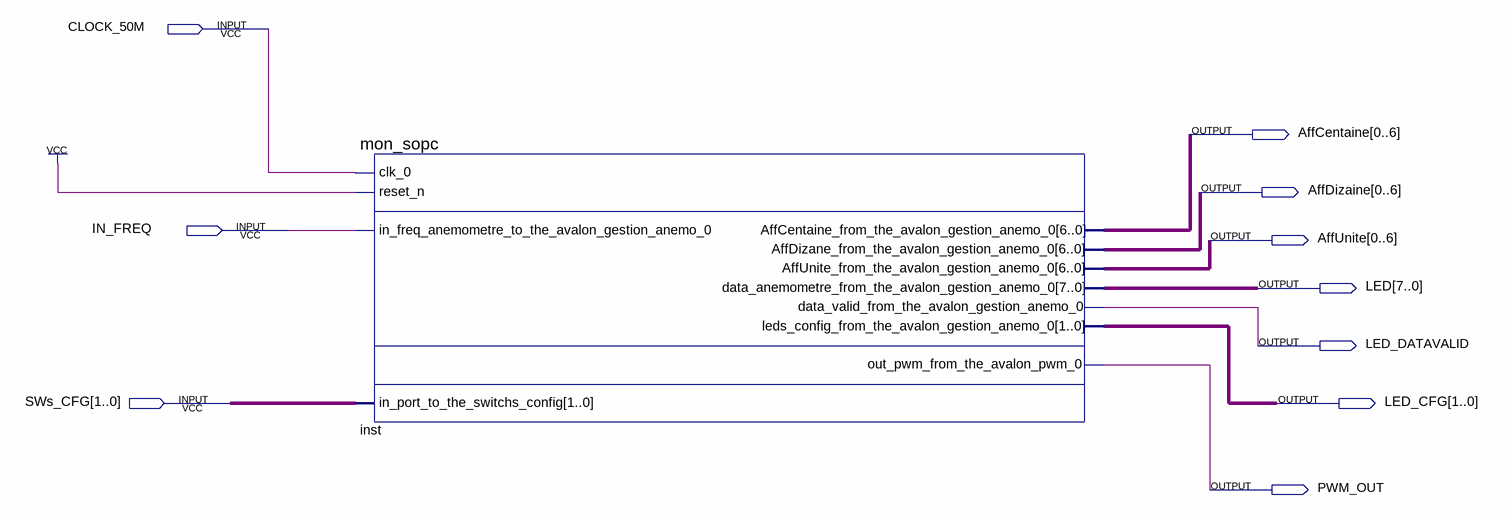
[diagram p0: schematic sheet]
// Quartus schematic sopc_be_Q11.bdf as structural Verilog: 1 symbols, 10 pins
module sopc_be_Q11 (
  input  CLOCK_50M,
  input  IN_FREQ,
  input  [1:0] SWs_CFG,
  output [0:6] AffCentaine,
  output [0:6] AffDizaine,
  output [0:6] AffUnite,
  output [7:0] LED,
  output LED_DATAVALID,
  output [1:0] LED_CFG,
  output PWM_OUT
);

  mon_sopc inst (
    .clk_0(CLOCK_50M), .reset_n(1'b1), .in_freq_anemometre_to_the_avalon_gestion_anemo_0(IN_FREQ),
    .in_port_to_the_switchs_config(SWs_CFG), .AffCentaine_from_the_avalon_gestion_anemo_0(AffCentaine),
    .AffDizane_from_the_avalon_gestion_anemo_0(AffDizaine),
    .AffUnite_from_the_avalon_gestion_anemo_0(AffUnite),
    .data_anemometre_from_the_avalon_gestion_anemo_0(LED),
    .data_valid_from_the_avalon_gestion_anemo_0(LED_DATAVALID),
    .leds_config_from_the_avalon_gestion_anemo_0(LED_CFG), .out_pwm_from_the_avalon_pwm_0(PWM_OUT));
endmodule
